# Altium schematic sheet Digital_Input.SchDoc
size A4; SheetNumber: 2; SheetTotal: 16
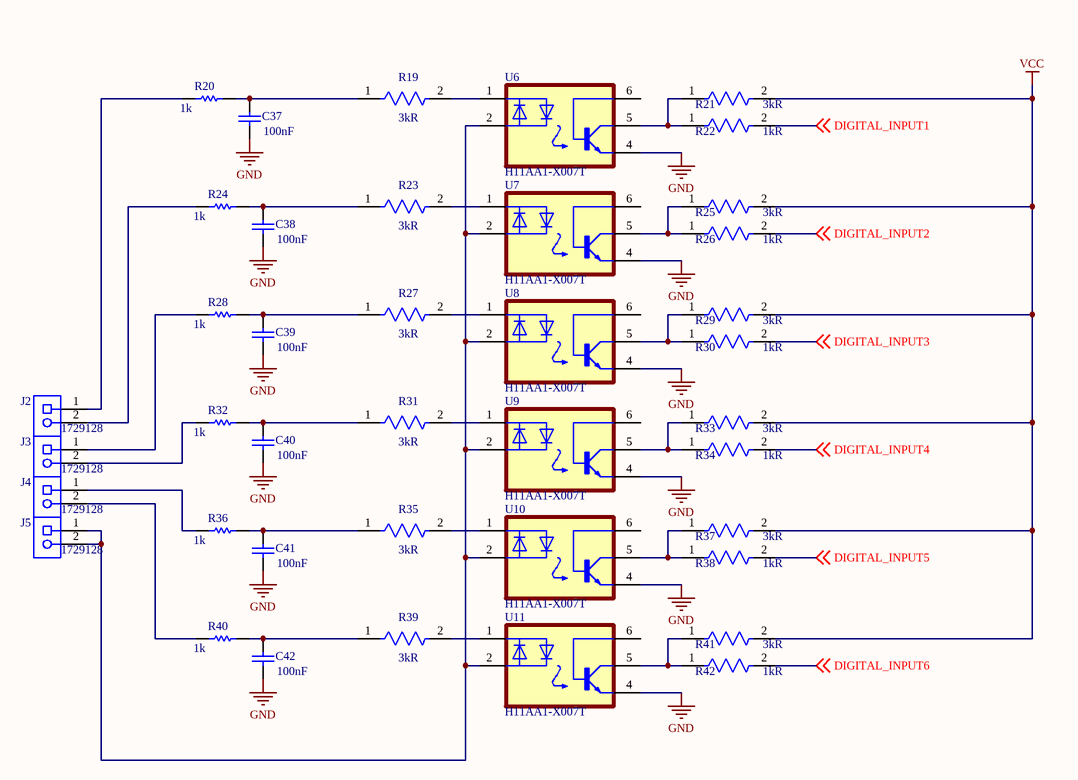
[diagram p0: Digital_Input.SchDoc]

## Parts
C37  value 100nF  [CAPC1608X87X35NL15T15]  (hidden comment: C0603T104K3RACTU)
C38  value 100nF  [CAPC1608X87X35NL15T15]  (hidden comment: C0603T104K3RACTU)
C39  value 100nF  [CAPC1608X87X35NL15T15]  (hidden comment: C0603T104K3RACTU)
C40  value 100nF  [CAPC1608X87X35NL15T15]  (hidden comment: C0603T104K3RACTU)
C41  value 100nF  [CAPC1608X87X35NL15T15]  (hidden comment: C0603T104K3RACTU)
C42  value 100nF  [CAPC1608X87X35NL15T15]  (hidden comment: C0603T104K3RACTU)
J2  1729128  [PHOE-1729128-2_V]
J3  1729128  [PHOE-1729128-2_V]
J4  1729128  [PHOE-1729128-2_V]
J5  1729128  [PHOE-1729128-2_V]
R19  Resistance: 3kR  [FP-CRCW0603-e3-IPC_A]  (hidden comment: CRCW06033K00FKEA)
R20  value 1k  [RESC1608X55X25LL10T15]  (hidden comment: RT0603DRE071KL)
R21  Resistance: 3kR  [FP-CRCW0603-e3-IPC_A]  (hidden comment: CRCW06033K00FKEA)
R22  Resistance: 1kR  [FP-RC0603-0_55-IPC_C]  (hidden comment: RC0603FR-071KL)
R23  Resistance: 3kR  [FP-CRCW0603-e3-IPC_A]  (hidden comment: CRCW06033K00FKEA)
R24  value 1k  [RESC1608X55X25LL10T15]  (hidden comment: RT0603DRE071KL)
R25  Resistance: 3kR  [FP-CRCW0603-e3-IPC_A]  (hidden comment: CRCW06033K00FKEA)
R26  Resistance: 1kR  [FP-RC0603-0_55-IPC_C]  (hidden comment: RC0603FR-071KL)
R27  Resistance: 3kR  [FP-CRCW0603-e3-IPC_A]  (hidden comment: CRCW06033K00FKEA)
R28  value 1k  [RESC1608X55X25LL10T15]  (hidden comment: RT0603DRE071KL)
R29  Resistance: 3kR  [FP-CRCW0603-e3-IPC_A]  (hidden comment: CRCW06033K00FKEA)
R30  Resistance: 1kR  [FP-RC0603-0_55-IPC_C]  (hidden comment: RC0603FR-071KL)
R31  Resistance: 3kR  [FP-CRCW0603-e3-IPC_A]  (hidden comment: CRCW06033K00FKEA)
R32  value 1k  [RESC1608X55X25LL10T15]  (hidden comment: RT0603DRE071KL)
R33  Resistance: 3kR  [FP-CRCW0603-e3-IPC_A]  (hidden comment: CRCW06033K00FKEA)
R34  Resistance: 1kR  [FP-RC0603-0_55-IPC_C]  (hidden comment: RC0603FR-071KL)
R35  Resistance: 3kR  [FP-CRCW0603-e3-IPC_A]  (hidden comment: CRCW06033K00FKEA)
R36  value 1k  [RESC1608X55X25LL10T15]  (hidden comment: RT0603DRE071KL)
R37  Resistance: 3kR  [FP-CRCW0603-e3-IPC_A]  (hidden comment: CRCW06033K00FKEA)
R38  Resistance: 1kR  [FP-RC0603-0_55-IPC_C]  (hidden comment: RC0603FR-071KL)
R39  Resistance: 3kR  [FP-CRCW0603-e3-IPC_A]  (hidden comment: CRCW06033K00FKEA)
R40  value 1k  [RESC1608X55X25LL10T15]  (hidden comment: RT0603DRE071KL)
R41  Resistance: 3kR  [FP-CRCW0603-e3-IPC_A]  (hidden comment: CRCW06033K00FKEA)
R42  Resistance: 1kR  [FP-RC0603-0_55-IPC_C]  (hidden comment: RC0603FR-071KL)
U6  H11AA1-X007T  [SOIC254P1030X460-6N]
U7  H11AA1-X007T  [SOIC254P1030X460-6N]
U8  H11AA1-X007T  [SOIC254P1030X460-6N]
U9  H11AA1-X007T  [SOIC254P1030X460-6N]
U10  H11AA1-X007T  [SOIC254P1030X460-6N]
U11  H11AA1-X007T  [SOIC254P1030X460-6N]

## Nets
GND: C37.1 C38.1 C39.1 C40.1 C41.1 C42.1 U6.4(E) U7.4(E) U8.4(E) U9.4(E) U10.4(E) U11.4(E)
VCC: R21.2 R25.2 R29.2 R33.2 R37.2 R41.2
DIGITAL_INPUT1: R22.2 ; off-sheet DIGITAL_INPUT1
DIGITAL_INPUT2: R26.2 ; off-sheet DIGITAL_INPUT2
DIGITAL_INPUT3: R30.2 ; off-sheet DIGITAL_INPUT3
DIGITAL_INPUT4: R34.2 ; off-sheet DIGITAL_INPUT4
DIGITAL_INPUT5: R38.2 ; off-sheet DIGITAL_INPUT5
DIGITAL_INPUT6: R42.2 ; off-sheet DIGITAL_INPUT6
NetC37_2: C37.2 R19.1 R20.2
NetC38_2: C38.2 R23.1 R24.2
NetC39_2: C39.2 R27.1 R28.2
NetC40_2: C40.2 R31.1 R32.2
NetC41_2: C41.2 R35.1 R36.2
NetC42_2: C42.2 R39.1 R40.2
NetJ2_1: J2.1 R20.1
NetJ2_2: J2.2 R24.1
NetJ3_1: J3.1 R28.1
NetJ3_2: J3.2 R32.1
NetJ4_1: J4.1 R36.1
NetJ4_2: J4.2 R40.1
NetJ5_1: J5.1 J5.2 U6.2(C/A) U7.2(C/A) U8.2(C/A) U9.2(C/A) U10.2(C/A) U11.2(C/A)
NetR19_2: R19.2 U6.1(A/C)
NetR21_1: R21.1 R22.1 U6.5(C)
NetR23_2: R23.2 U7.1(A/C)
NetR25_1: R25.1 R26.1 U7.5(C)
NetR27_2: R27.2 U8.1(A/C)
NetR29_1: R29.1 R30.1 U8.5(C)
NetR31_2: R31.2 U9.1(A/C)
NetR33_1: R33.1 R34.1 U9.5(C)
NetR35_2: R35.2 U10.1(A/C)
NetR37_1: R37.1 R38.1 U10.5(C)
NetR39_2: R39.2 U11.1(A/C)
NetR41_1: R41.1 R42.1 U11.5(C)

Not connected (* = marked no-connect by the designer): U6 6(B); U7 6(B); U8 6(B); U9 6(B); U10 6(B); U11 6(B)

## Library data of the parts
C37-C42 = CMP-2006-03843-1: Manufacturer: Kemet; Part Number: C0603T104K3RACTU
J2-J5 = CMP-2000-05815-1: PCB Terminal Block, 13.5 A, 400 V, 2-Pin THD, RoHS, Bulk; Manufacturer: Phoenix Contact; Package Version: 03/2015; No. of Rows: 1; Pitch: 5.08mm; No. of Positions: 2; Voltage Rating: 400V; Current Rating: 13500mA; Manufacturer URL: http://www.phoenixcontact.com/; Datasheet URL: https://datasheet.ciiva.com/16046/1729128-16046181.pdf; RoHS: TRUE; Package URL: https://www.phoenixcontact.com/online/portal/pi/pxc/product_detail_page/!ut/p/b1/3VdJjqNKFDxLH8AFycySyWY2ozFsEPOMMQaDOX1XedGL_1Vdm5YXJleknhSKeBkvI6EA8ncAo3AYoDhBQGco6KN7VURTdemj9us_IEKEZo_YHiPAEWEFmDGOHMORkqKYCORBZxgL7ZoaZYcbFFUZ3fqxSY6GOuxydWUuHqz1ynmMFygu583Bob0Ewr6Sd_l-5m-kAueHiB0jpRwZwe58wwtkpxtMYd_LmGcDRU02dRNEyWt6Y2ti5pSyJ_reIkzIulrqApdnbT11V5jnCKbYNCvhEM1MCpPByat_X379-iThf08CI5GfOPqfBeS3BRoBOdD55AKVv0iLwCMq-2BrzXWSGRH7pUGD9uwXQjiph3xL0DKQwdGa0JImiIOmBNOestqgwTHSSs2oOep-78apyXQBvNi8ZLaFjvjWvcaUEBu0MC6Wbe-d6mB0FAebo2lUWinqYaZs5DAYzV0RP9yitUjnGJ0iI9xhZkT42OCQNUJJhkgWINNQLP2JFP6OpMg3JCVg70jqHT0lvKOnhHf0lPuOnnLf0VPuWx6_dxwUIvwk5WMkT0kLL1mh61l2yZVSzG3pYV_bqo-mj6uMKwKwdnnW8Jh5RTOJzMOA5c-eJDaZQw4mTMPH02PvS_ZAqNVjVTo2WyYLkwH_KU1mmmG5kjRhDqPXLwwVHvVOjCM60-fpXvTDfMGW1PVFVS1r4e4yVDk4ZdNbkUHvqPqQSeian4UD39fNKmachqdJ1NJbyk8rXT9mXTvPk3oE5meulKGgiruPJek-4I9hTT6G8ZLOyRSm2RRVbThERQad5OS28hdt4YW4vG0stgYYzsWsK4_7y6DZMjJSCqri1kyiZR5vD7pwIrNR7QwPHTcLTI5qT7eRlpHrdGiupYlqQDJ7zy_CND8fWWBoLRXxk1RVcXiBQwbTD4Xi7KL-FuO94t9xaqweXzH; PartNumber: 1729128; Package Description: 2-Pin Through Hole Device, Body 8.1 x 10.16 mm, Pitch 5.08 mm; Datasheet Version: 12/2013; Mounting Technology: ThroughHole; Orientation: Horizontal; Package Reference: 1729128-2; Packing: Bulk
R19 R21 R23 R25 R27 R29 R31 R33 R35 R37 R39 R41 = CMP-2000-03293-2: RES Thick Film, 3kΩ, 1%, 0.1W, 100ppm/°C, 0603; Voltage Rating: 75V; Power Rating: 100mW; Features: Automotive AEC-Q200; Radiation Hardening: No; Contact Plating: Tin; Termination: SMD/SMT; Lead Free: Lead Free; Case Code (Imperial): 0603; Case Code (Metric): 1608; Case/Package: 0603; Depth: 0.85mm; Mount: Surface Mount; Voltage Rating (DC): 75V; Tolerance: 1%; Package Quantity: 10; Temperature Coefficient: 100ppm/°C; Height: 0.45mm; Max Power Dissipation: 100mW; Composition: Thick Film; Max Operating Temperature: 155°C; Military Standard: Not; Weight: 7.1E-05oz; Length: 1.55mm; Packaging: Tape and Reel; Number of Terminations: 2; Width: 0.85mm; Min Operating Temperature: -55°C
R20 R24 R28 R32 R36 R40 = CMP-2000-04615-1: Manufacturer: Yageo; Part Number: RT0603DRE071KL
R22 R26 R30 R34 R38 R42 = CMP-1659-00009-5: RES 1K OHM 1% 1/10W 0603; Voltage Rating: 50V; Power Rating: 100mW; Temperature Coefficient: 100ppm/°C; Military Standard: Not; REACH SVHC: No SVHC; Size Code: 0603; Features: Moisture Resistant; Number of Terminations: 2; Technology: THICK FILM; Series: RC; Case Code (Metric): 1608; Resistance Tolerance: 1%; Resistor Type: Thick Film; Termination: SMD/SMT; Contact Plating: Tin; Radiation Hardening: No; Min Operating Temperature: -55°C; Max Operating Temperature: 155°C; Packaging: Tape and Reel; Max Power Dissipation: 100mW; RoHS Compliant: Yes; Height: 0.45mm; Lead Free: Lead Free; Case/Package: 0603; Length: 1.6mm; Tolerance: 1%; Case Code (Imperial): 0603; Construction: Rectangular; Depth: 0.8mm
U6-U11 = H11AA1-X007T: H11AA1 Series Single Channel 30V 5300 Vrms SMT Phototransistor Optocoupler DIP-6; MF: Vishay Semiconductor; SnapEDA_Link: https://www.snapeda.com/parts/H11AA1-X007T/Vishay/view-part/?ref=snap; Package: SMD-6 Vishay; Value: *; MP: H11AA1-X007T; Check_prices: https://www.snapeda.com/parts/H11AA1-X007T/Vishay/view-part/?ref=eda